# Altium schematic sheet [02] - DIAGRAMA DE BLOCOS.SchDoc
size A3; DocumentNumber: 2; SheetNumber: 2; SheetTotal: 6
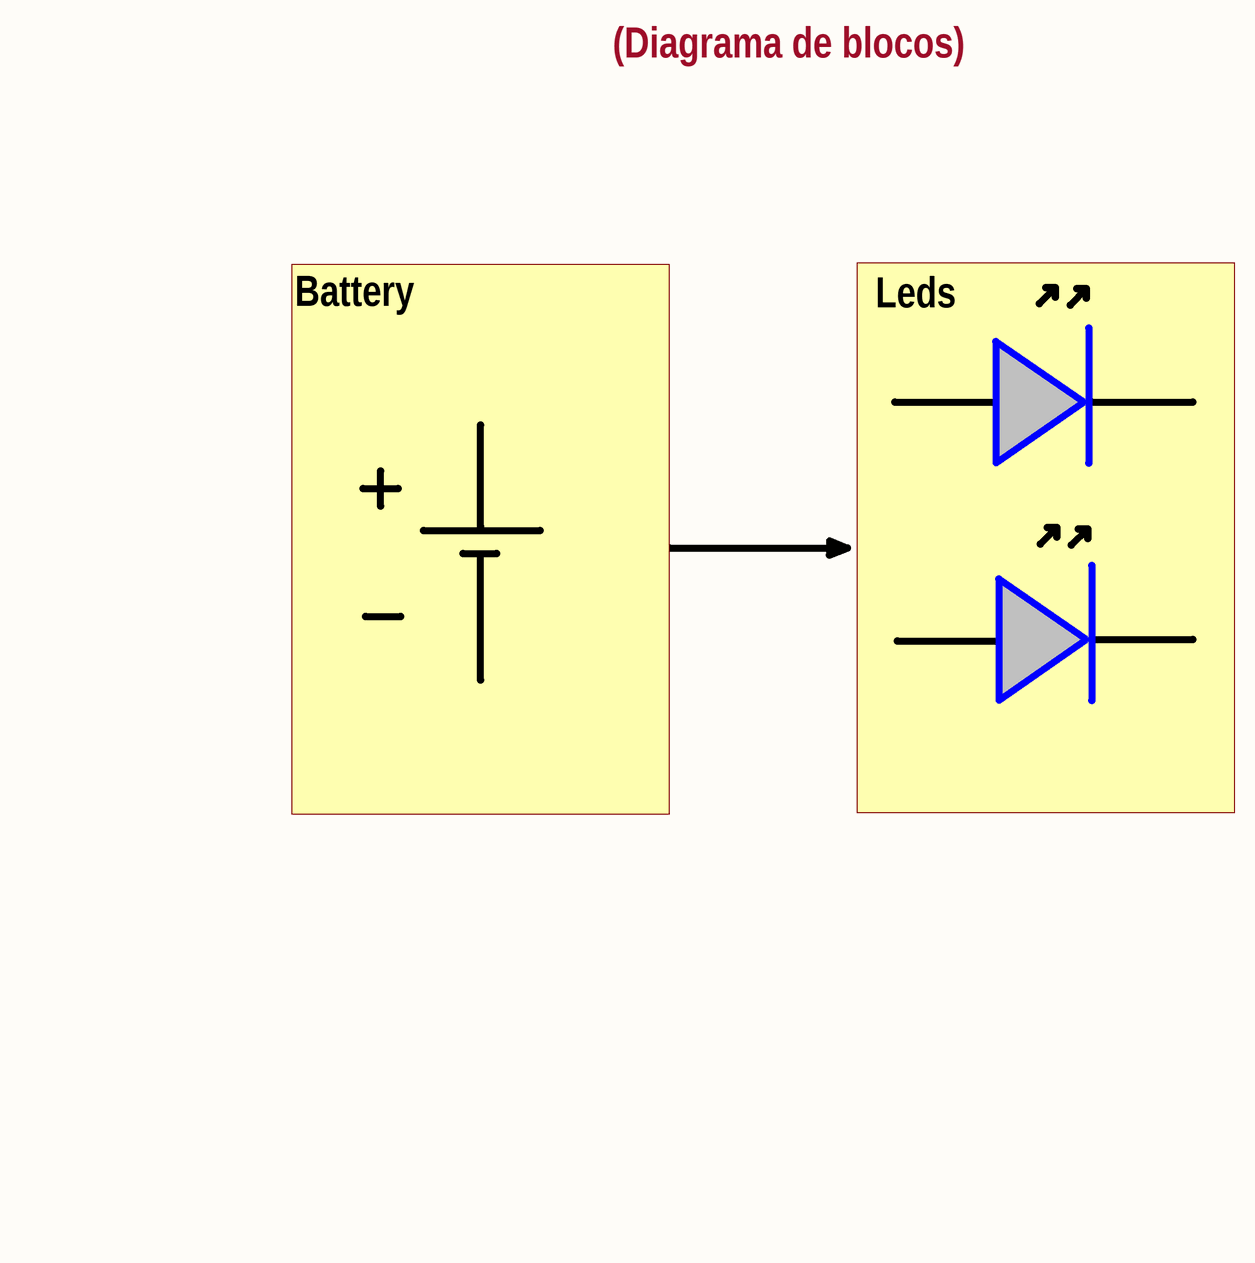
[diagram p0: [02] - DIAGRAMA DE BLOCOS.SchDoc]

## Notes on the sheet
- (Diagrama de blocos)
- Battery
- Leds
- CLOCKS (CPU & PCIE)
- Projeto:
- Ancient Egypt Ltda
- Revisão:
- Engenheiro:
- Titulo:
- Pág
- de
- Pyramides of Giza, 777
- Cairo
- www.ancientegypt.com.eg
- Data:
- Hora:
- Variante: